# EasyEDA Pro project 视觉车.eprj, schematic 视觉车
Board Name: 小车课设1.1; Create Date: 2024-11-14; Page Name: Sheet_1; Project Name: 小车1.1_2023-11-30_16-59-00; Schematic Name: 小车课设1.1; Update Date: 2024-11-14; Add into BOM: yes; Company: Your Company; Convert to PCB: yes; Date: 2022-5-10; Draw By: qijianfeng; REV: 1.0; Sheet: 1/1
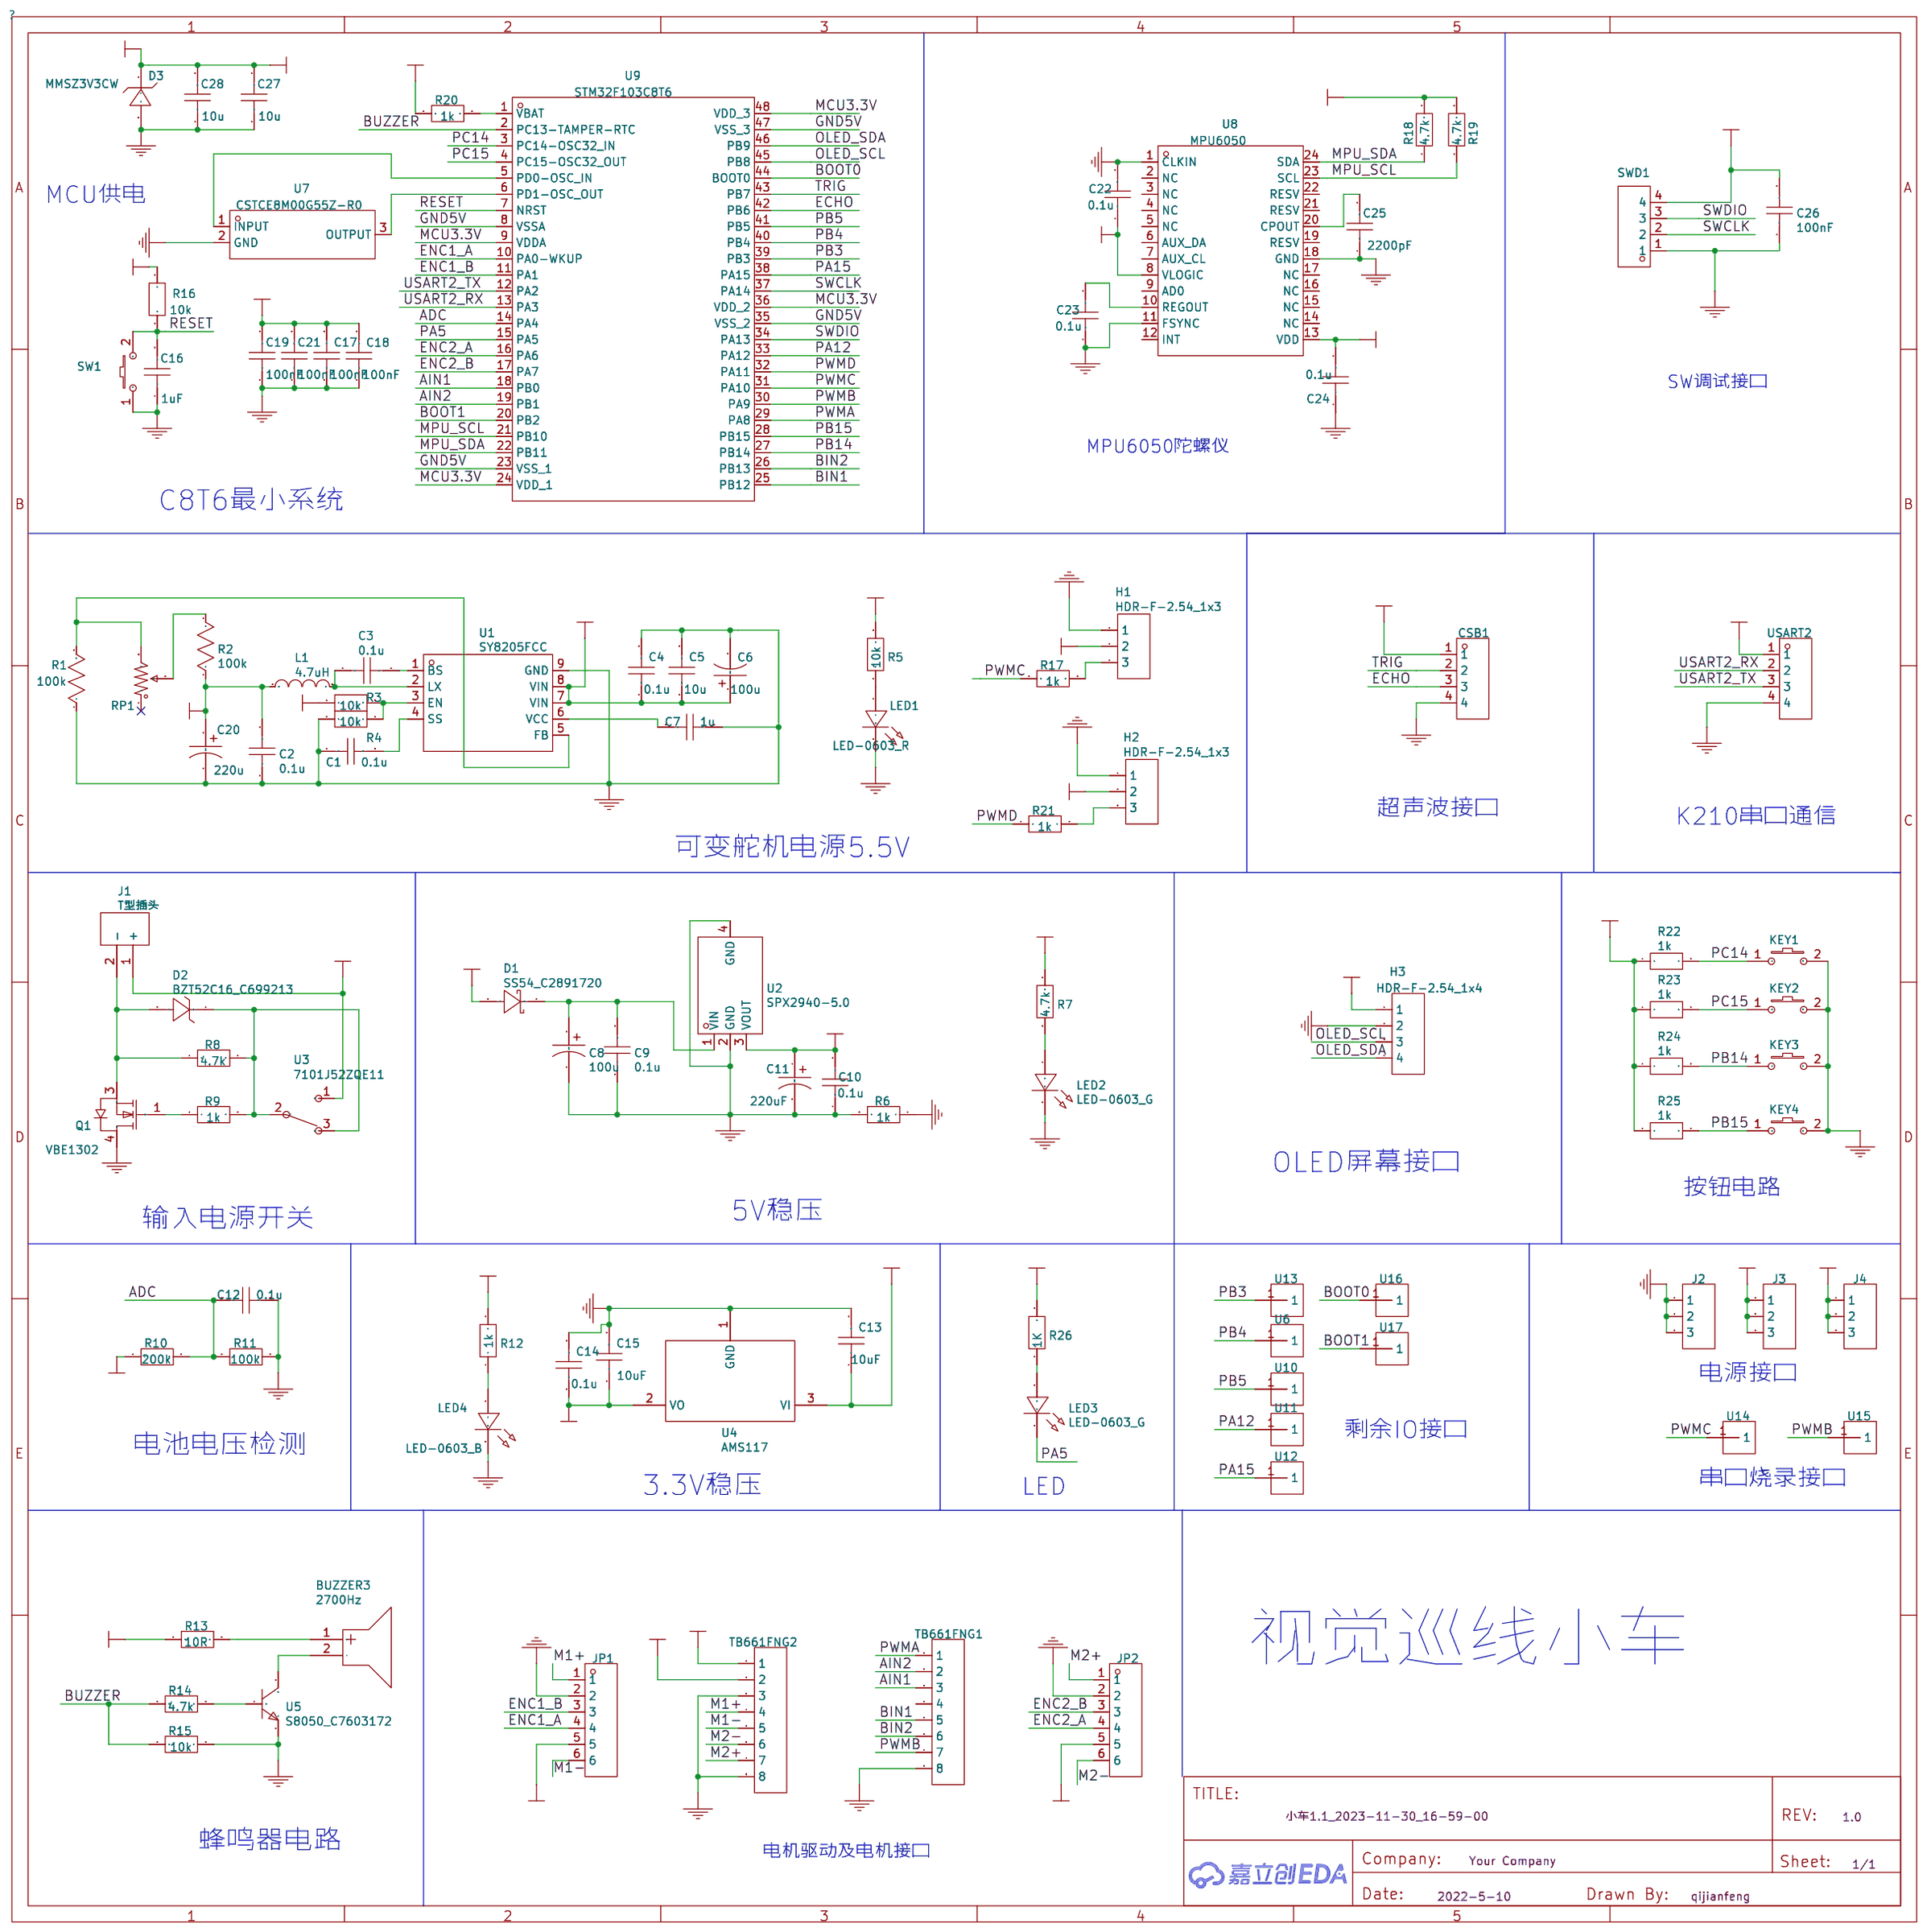
[diagram p0: schematic sheet]

## Parts
BUZZER3  2700Hz  [BUZ-TH_BD9.0-P5.00-D0.6-FD]
C1  0.1u  [C0603]
C2  0.1u  [C0603]
C3  0.1u  [C0603]
C4  0.1u  [C0603]
C5  10u  [C0603]
C6  100u  [CAP-D6.3×H5.5]
C7  1u  [C0603]
C8  100u  [CAP-D6.3×H5.5]
C9  0.1u  [C0603]
C10  0.1u  [C0603]
C11  220uF  [CAP-D6.3×H5.5]
C12  0.1u  [C0805]
C13  10uF  [C0603_1]
C14  0.1u  [C0603_1]
C15  10uF  [C0603_1]
C16  1uF  [C0603]
C17  100nF  [C0603]
C18  100nF  [C0603]
C19  100nF  [C0603]
C20  220u  [CAP-D6.3×H5.5]
C21  100nF  [C0603]
C22  0.1u  [C0603]
C23  0.1u  [C0603]
C24  0.1u  [C0603]
C25  2200pF  [C0603]
C26  100nF  [C0603]
C27  10u  [C0603]
C28  10u  [C0603]
CSB1  CSB  [HDR-TH_4P-P2.54-V-M]
D1  SS54_C2891720  [DO-214AC_L4.3-W2.7-LS5.2-RD]
D2  BZT52C16_C699213  [SOD-123_L2.7-W1.6-LS3.7-RD-1]
D3  MMSZ3V3CW  [SOD-123_L2.8-W1.8-LS3.7-RD]
H1  HDR-F-2.54_1x3  [HDR-F-2.54_1X3]
H2  HDR-F-2.54_1x3  [HDR-F-2.54_1X3]
H3  HDR-F-2.54_1x4  [HDR-F-2.54_1X4]
J1  T型插头  [T型插头]
J2  HDR-M-2.54_1x3  [HDR-M-2.54_1X3]
J3  HDR-M-2.54_1x3  [HDR-M-2.54_1X3]
J4  HDR-M-2.54_1x3  [HDR-M-2.54_1X3]
JP1  XH2.54-6P  [CONN-TH_XH2.54-6P]
JP2  XH2.54-6P  [CONN-TH_XH2.54-6P]
KEY1  K2-3.6×6.1_SMD  [KEY-SMD_2P-L6.2-W3.6-LS8.0]
KEY2  K2-3.6×6.1_SMD  [KEY-SMD_2P-L6.2-W3.6-LS8.0]
KEY3  K2-3.6×6.1_SMD  [KEY-SMD_2P-L6.2-W3.6-LS8.0]
KEY4  K2-3.6×6.1_SMD  [KEY-SMD_2P-L6.2-W3.6-LS8.0]
L1  4.7uH  [IND-SMD_L4.2-W4.2_GNR4018PM-4R7M]
LED1  LED-0603_R  [LED0603_RED]
LED2  LED-0603_G  [LED0603_GREEN]
LED3  LED-0603_G  [LED0603_GREEN]
LED4  LED-0603_B  [LED0603_BLUE]
Q1  VBE1302  [TO-252-2_L6.6-W6.1-P4.58-LS9.9-TL-1_1]
R1  100k  [R0603]
R2  100k  [R0603]
R3  10k  [R0603]
R4  10k  [R0603]
R5  10k  [R0603]
R6  1k  [R1206]
R7  4.7k  [R0603]
R8  4.7k  [R0805]
R9  1k  [R0805]
R10  200k  [R0805]
R11  100k  [R0805]
R12  1k  [R0603_1]
R13  10R  [R0603_1]
R14  4.7k  [R0603_1]
R15  10k  [R0603_1]
R16  10k  [R0603]
R17  1k  [R0603_1]
R18  4.7k  [R0603]
R19  4.7k  [R0603]
R20  1k  [R0603]
R21  1k  [R0603_1]
R22  1k  [R0603_1]
R23  1k  [R0603_1]
R24  1k  [R0603_1]
R25  1k  [R0603_1]
R26  1K  [R0603]
RP1  R_3296W_US  [RES-ADJ-TH_3296W]
SW1  K2-3.6×6.1_SMD  [KEY-SMD_2P-L6.2-W3.6-LS8.0]
SWD1  CSB  [HDR-TH_4P-P2.54-V-M]
TB661FNG1  TB661FNG1  [HDR-TH_8P-P2.54-V-F-1]
TB661FNG2  TB661FNG2  [HDR-TH_8P-P2.54-V-F-1]
U1  SY8205FCC  [SOIC-8_L5.0-W4.0-P1.27-LS6.0-BL-EP2.0]
U2  SPX2940-5.0  [TO-263-3_L10.2-W9.0-P2.54-LS15.2-TL]
U3  7101J52ZQE11  [SW-TH_3P-L12.7-W6.8-P4.70]
U4  AMS117  [AMS117-3.3]
U5  S8050_C7603172  [SOT-23-3_L2.9-W1.6-P1.90-LS2.8-BR]
U6  小焊盘  [焊盘]
U7  CSTCE8M00G55Z-R0  [OSC-SMD_3P-L3.2-W1.3-P1.20]
U8  MPU6050  [QFN-24_L4.0-W4.0-P0.50-BL]
U9  STM32F103C8T6  [LQFP-48_L7.0-W7.0-P0.50-LS9.0-BL]
U10  小焊盘  [焊盘]
U11  小焊盘  [焊盘]
U12  小焊盘  [焊盘]
U13  小焊盘  [焊盘]
U14  小焊盘  [焊盘]
U15  小焊盘  [焊盘]
U16  小焊盘  [焊盘]
U17  小焊盘  [焊盘]
USART2  CSB  [HDR-TH_4P-P2.54-V-M]

## Library data of the parts
BUZZER3 = 2700Hz: Supplier: LCSC; Supplier Part: C409832; Manufacturer: Fengming(锋鸣电子); Manufacturer Part: YS-MBZ9055DYB05; JLCPCB Part Class: Extended Part
C1-C4 C9 C10 C22-C24 = 0.1u
C5 C27 C28 = 10u
C6 C8 = 100u
C7 = 1u
C11 = 220uF
C12 = 0.1u_2
C13 C15 = 10uF_1
C14 = 0.1u_1
C16 = 1uF
C17-C19 C21 C26 = 100nF
C20 = 220u
C25 = 2200pF
CSB1 SWD1 USART2 = Z-21104110021001: Supplier: LCSC; Manufacturer: Nextron(正凌); Supplier Part: C152150; JLCPCB Part Class: Extended Part
D1 = SS54_C2891720: Supplier: LCSC; Supplier Part: C2891720; Manufacturer: KUU; Manufacturer Part: SS54
D2 = BZT52C16_C699213: Supplier: LCSC; Supplier Part: C699213; Manufacturer: YANGJIE(扬杰); Manufacturer Part: BZT52C16; JLCPCB Part Class: Extended Part
D3 = MMSZ3V3CW: Supplier: LCSC; Supplier Part: C248750; Manufacturer: TC(德昌); JLCPCB Part Class: Extended Part
H1 H2 = HDR-F-2.54_1x3: Supplier Part: C146690; Supplier: LCSC
H3 = HDR-F-2.54_1x4: Supplier Part: C225501; Supplier: LCSC
J1 = T型插头: Supplier: 逐飞科技
J2-J4 = HDR-M-2.54_1x3: Supplier Part: C180248; Supplier: LCSC
JP1 JP2 = XH2.54-6P 直插: Supplier: LCSC; Supplier Part: C9900000754; Manufacturer: null; JLCPCB Part Class: Extended Part
KEY1-KEY4 SW1 = K2-1107ST-A4SW-06: Supplier Part: C118141; Supplier: LCSC; 制造商: 韩国韩荣
L1 = 4.7uH: Supplier: LCSC; Manufacturer: gotrend(高创科技); Manufacturer Part: GNR4018PM-4R7M; Supplier Part: C142409; JLCPCB Part Class: Extended Part
LED1 = 19-217/R6C-AL1M2VY/3T: Manufacturer: EVERLIGHT(台湾亿光); Supplier Part: C72044; Supplier: LCSC
LED2 LED3 = 19-217/GHC-YR1S2/3T: Manufacturer: EVERLIGHT(台湾亿光); Supplier Part: C72043; Supplier: LCSC
LED4 = 19-217/BHC-ZL1M2RY/3T: Manufacturer: EVERLIGHT(台湾亿光); Supplier Part: C72041; Supplier: LCSC
Q1 = VBE1302: Supplier: LCSC; Supplier Part: C480950; Manufacturer: VBsemi(微碧); JLCPCB Part Class: Extended Part
R1 R2 = 100k_1
R3-R5 R16 = 10k_1
R6 = 1k
R7 R18 R19 = 4.7k
R8 = 4.7k_2
R9 = 1k_2
R10 = 200k
R11 = 100k
R12 R17 R21-R25 = 1k_1
R13 = 10R
R14 = 4.7k_1
R15 = 10k
R20 = 1k_3
R26 = 1K
RP1 = R_3296W_US: Supplier: LCSC; value(Ω): 10K
TB661FNG1 TB661FNG2 = 2.54-1*8P母环保: Supplier: LCSC; Manufacturer: BOOMELE(博穆精密); Supplier Part: C27438; JLCPCB Part Class: Extended Part
U1 = SY8205FCC: Supplier: LCSC; Supplier Part: C111875; Manufacturer: silergy(矽力杰); JLCPCB Part Class: Extended Part
U2 = SPX2940-5.0: Supplier: LCSC; Supplier Part: C9900007906; Manufacturer: null; JLCPCB Part Class: Extended Part
U3 = 7101J52ZQE11: Supplier: LCSC; Supplier Part: C2819301; Manufacturer: C&amp;K
U4 = AMS117
U5 = S8050_C7603172: Supplier: LCSC; Supplier Part: C7603172; Manufacturer: KUU(永裕泰); Manufacturer Part: S8050
U6 U10-U17 = 小焊盘
U7 = CSTCE8M00G55Z-R0: Supplier: LCSC; Supplier Part: C882610; Manufacturer: null; JLCPCB Part Class: Extended Part
U8 = MPU6050: Supplier: LCSC; Supplier Part: C9900042518; Manufacturer: null
U9 = STM32F103C8T6: Supplier: LCSC; Manufacturer: ST(意法半导体); Supplier Part: C8734; JLCPCB Part Class: Basic Part

## Nets
3.3V: C14.1 C15.1 C17.2 C18.2 C19.2 C21.2 C22.1 C24.2 C26.2 C27.2 C28.2 D3.1(K) H3.1 J3.1 J3.2 J3.3 R12.2 R13.1 R16.1 R18.2 R19.2 R20.1 R22.1 R23.1 R24.1 R25.1 R26.2 SWD1.4 U4.2(VO) U8.8(VLOGIC) U8.13(VDD) U9.9(VDDA) U9.24(VDD_1) U9.36(VDD_2) U9.48(VDD_3)
5V: C10.2 C11.1 C13.1 CSB1.1 J4.1 J4.2 J4.3 JP1.5 JP2.5 R7.2 TB661FNG2.2 U2.3(VOUT) U4.3(VI) USART2.1
GND5V: C13.2 C14.2 C15.2 C16.1 C17.1 C18.1 C19.1 C21.1 C22.2 C23.1 C24.1 C25.1 C26.1 C27.1 C28.1 CSB1.4 D3.2(A) H3.2 J2.1 J2.2 J2.3 KEY1.2 KEY2.2 KEY3.2 KEY4.2 LED4.2 R6.1 R15.2 SW1.1 SWD1.1 U4.1(GND) U5.2(E) U7.2(GND) U8.1(CLKIN) U8.11(FSYNC) U8.18(GND) U9.8(VSSA) U9.23(VSS_1) U9.35(VSS_2) U9.47(VSS_3) USART2.4
GNDVIN: C1.1 C2.1 C4.2 C5.2 C6.2 C7.2 C8.2 C9.1 C10.1 C11.2 C12.2 C20.2 H1.1 H2.1 JP1.2 JP2.2 LED1.2 LED2.2 Q1.4(D) R1.1 R4.1 R6.2 R11.2 TB661FNG1.8 TB661FNG2.3 TB661FNG2.8 U1.9(GND) U2.2(GND) U2.4(GND)
VIN: C4.1 C5.1 C6.1 D1.2(A) J1.1(+) R3.1 R10.1 TB661FNG2.1 U1.7(VIN) U1.8(VIN) U3.1
ADC: C12.1 R10.2 R11.1 U9.14(PA4)
AIN1: TB661FNG1.3 U9.18(PB0)
AIN2: TB661FNG1.2 U9.19(PB1)
BIN1: TB661FNG1.5 U9.25(PB12)
BIN2: TB661FNG1.6 U9.26(PB13)
BOOT0: U9.44(BOOT0) U16.1
BOOT1: U9.20(PB2) U17.1
BUZZER: R14.1 R15.1 U9.2(PC13-TAMPER-RTC)
ECHO: CSB1.3 U9.42(PB6)
ENC1_A: JP1.4 U9.10(PA0-WKUP)
ENC1_B: JP1.3 U9.11(PA1)
ENC2_A: JP2.4 U9.16(PA6)
ENC2_B: JP2.3 U9.17(PA7)
M1+: JP1.1 TB661FNG2.4
M1-: JP1.6 TB661FNG2.5
M2+: JP2.1 TB661FNG2.7
M2-: JP2.6 TB661FNG2.6
MPU_SCL: R19.1 U8.23(SCL) U9.21(PB10)
MPU_SDA: R18.1 U8.24(SDA) U9.22(PB11)
OLED_SCL: H3.3 U9.45(PB8)
OLED_SDA: H3.4 U9.46(PB9)
PA5: LED3.2 U9.15(PA5)
PA12: U9.33(PA12) U11.1
PA15: U9.38(PA15) U12.1
PB3: U9.39(PB3) U13.1
PB4: U6.1 U9.40(PB4)
PB5: U9.41(PB5) U10.1
PB14: KEY3.1 R24.2 U9.27(PB14)
PB15: KEY4.1 R25.2 U9.28(PB15)
PC14: KEY1.1 R22.2 U9.3(PC14-OSC32_IN)
PC15: KEY2.1 R23.2 U9.4(PC15-OSC32_OUT)
PWMA: TB661FNG1.1 U9.29(PA8)
PWMB: TB661FNG1.7 U9.30(PA9) U15.1
PWMC: R17.1 U9.31(PA10) U14.1
PWMD: R21.1 U9.32(PA11)
RESET: C16.2 R16.2 SW1.2 U9.7(NRST)
SERVO_VCC: C2.2 C20.1 H1.2 H2.2 L1.1 R2.1 R5.2
SWCLK: SWD1.2 U9.37(PA14)
SWDIO: SWD1.3 U9.34(PA13)
TRIG: CSB1.2 U9.43(PB7)
USART2_RX: U9.13(PA3) USART2.2
USART2_TX: U9.12(PA2) USART2.3
C23_2: C23.2 U8.10(REGOUT)
C25_2: C25.2 U8.20(CPOUT)
J1_2: D2.2(A) J1.2(-) Q1.3(S) R8.1
LED3_1: LED3.1 R26.1
Net-(BUZZER3-1): BUZZER3.1(+) R13.2
Net-(BUZZER3-2): BUZZER3.2(-) U5.3(C)
Net-(H1-3): H1.3 R17.2
Net-(H2-3): H2.3 R21.2
Net-(LED2-1): LED2.1 R7.1
Net-(U7-1): U7.1(INPUT) U9.5(PD0-OSC_IN)
Net-(U7-3): U7.3(OUTPUT) U9.6(PD1-OSC_OUT)
R2_2: R2.2 RP1.2
R5_1: LED1.1 R5.1
R9_1: Q1.1(G) R9.1
R12_1: LED4.1 R12.1
U1_1: C3.1 U1.1(BS)
U1_2: C3.2 L1.2 U1.2(LX)
U1_3: R3.2 R4.2 U1.3(EN)
U1_4: C1.2 U1.4(SS)
U1_5: R1.2 RP1.3 U1.5(FB)
U1_6: C7.1 U1.6(VCC)
U2_1: C8.1 C9.2 D1.1(K) U2.1(VIN)
U3_3: D2.1(C) R8.2 R9.2 U3.2 U3.3
U5_1: R14.2 U5.1(B)
U9_1: R20.2 U9.1(VBAT)

Not connected (* = marked no-connect by the designer): RP1 1*; TB661FNG1 4; U8 2(NC) 3(NC) 4(NC) 5(NC) 6(AUX_DA) 7(AUX_CL) 9(AD0) 12(INT) 14(NC) 15(NC) 16(NC) 17(NC) 19(RESV) 21(RESV) 22(RESV)

## Notes on the sheet
- MCU供电
- SW调试接口
- MPU6050陀螺仪
- C8T6最小系统
- 超声波接口
- K210串口通信
- 可变舵机电源5.5V
- OLED屏幕接口
- 按钮电路
- 5V稳压
- 输入电源开关
- 电源接口
- 剩余IO接口
- 电池电压检测
- 串口烧录接口
- 3.3V稳压
- LED
- 视觉巡线小车
- 蜂鸣器电路
- 电机驱动及电机接口
